# Altium schematic sheet STM32.SchDoc
size A0; SheetNumber: 1; SheetTotal: 1
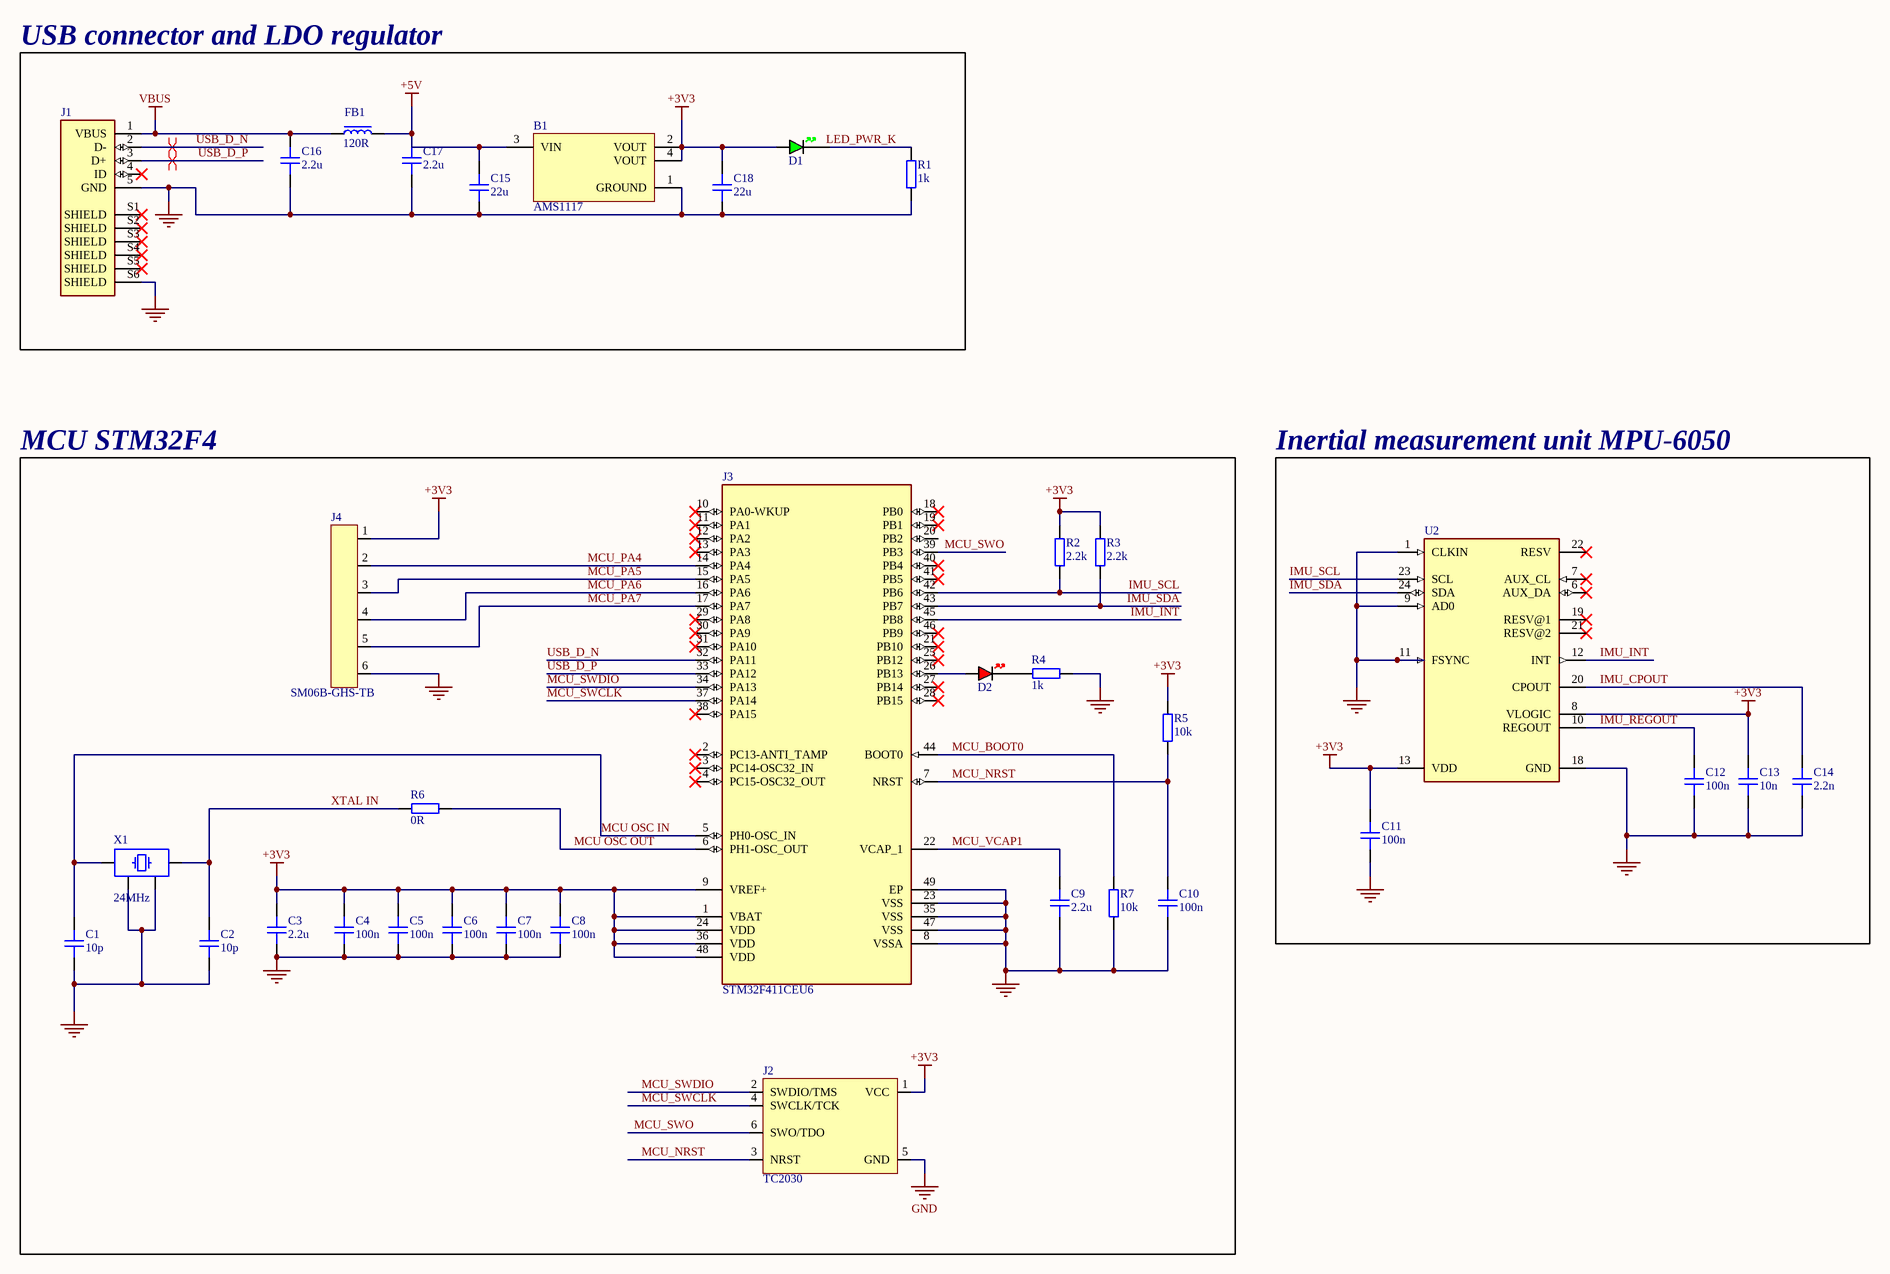
[diagram p0: STM32.SchDoc]

## Parts
B1  AMS1117  [SOT229P700X180-4N]
C1  10p  [CAP_0603]
C2  10p  [CAP_0603]
C3  2.2u  [CAP_0603]
C4  100n  [CAP_0402]
C5  100n  [CAP_0402]
C6  100n  [CAP_0402]
C7  100n  [CAP_0402]
C8  100n  [CAP_0402]
C9  2.2u  [CAP_0603]
C10  100n  [CAP_0402]
C11  100n  [CAP_0402]
C12  100n  [CAP_0402]
C13  10n  [CAP_0402]
C14  2.2n  [CAP_0402]
C15  22u  [CAP_0603]
C16  2.2u  [CAP_0603]
C17  2.2u  [CAP_0603]
C18  22u  [CAP_0603]
D1  GREEN  [LED_0402_GREEN]  (value not drawn)
D2  RED  [LED_0402_RED]  (value not drawn)
FB1  120R  [FB_0603]
J1  (no value)  [MOLEX_47346-0001]
J2  TC2030  [TC2030-FP]  (no BOM)
J3  STM32F411CEU6  [QFN50P700X700X60-49N]
J4  SM06B-GHS-TB  [SM06B-GHS-TB]
R1  1k  [RES_0402]
R2  2.2k  [RES_0402]
R3  2.2k  [RES_0402]
R4  1k  [RES_0402]
R5  10k  [RES_0402]
R6  0R  [RES_0402]
R7  10k  [RES_0402]
U2  (no value)  [QFN50P400X400X95-24N]
X1  24MHz  [XTAL_3225]

## Blocks framed on the sheet
USB connector and LDO regulator: B1 C15-C18 D1 FB1 J1 R1
MCU STM32F4: C1-C10 D2 J2-J4 R2-R7 X1
Inertial measurement unit MPU-6050: C11-C14 U2

## Nets
+3V3: B1.2(VOUT) B1.4(VOUT) C3.2 C4.2 C5.2 C6.2 C7.2 C8.2 C11.2 C13.2 C18.2 D1.A J2.1(VCC) J3.1(VBAT) J3.9(VREF+) J3.24(VDD) J3.36(VDD) J3.48(VDD) J4.1 R2.1 R3.1 R5.1 U2.8(VLOGIC) U2.13(VDD)
+5V: B1.3(VIN) C15.2 C17.2 FB1.2
GND: B1.1(GROUND) C1.1 C2.1 C3.1 C4.1 C5.1 C6.1 C7.1 C8.1 C9.1 C10.1 C11.1 C12.1 C13.1 C14.1 C15.1 C16.1 C17.1 C18.1 J1.5(GND) J1.S6(SHIELD) J2.5(GND) J3.8(VSSA) J3.23(VSS) J3.35(VSS) J3.47(VSS) J3.49(EP) J4.6 R1.1 R4.1 R7.2 U2.1(CLKIN) U2.9(AD0) U2.11(FSYNC) U2.18(GND) X1.2 X1.4
VBUS: C16.2 FB1.1 J1.1(VBUS)
IMU_CPOUT: C14.2 U2.20(CPOUT)
IMU_INT: J3.45(PB8) U2.12(INT)
IMU_REGOUT: C12.2 U2.10(REGOUT)
IMU_SCL: J3.42(PB6) R2.2 U2.23(SCL)
IMU_SDA: J3.43(PB7) R3.2 U2.24(SDA)
LED_PWR_K: D1.K R1.2
MCU OSC IN: C1.2 J3.5(PH0-OSC_IN) X1.1
MCU OSC OUT: J3.6(PH1-OSC_OUT) R6.2
MCU_BOOT0: J3.44(BOOT0) R7.1
MCU_NRST: C10.2 J2.3(NRST) J3.7(NRST) R5.2
MCU_PA4: J3.14(PA4) J4.2
MCU_PA5: J3.15(PA5) J4.3
MCU_PA6: J3.16(PA6) J4.4
MCU_PA7: J3.17(PA7) J4.5
MCU_SWCLK: J2.4(SWCLK/TCK) J3.37(PA14)
MCU_SWDIO: J2.2(SWDIO/TMS) J3.34(PA13)
MCU_SWO: J2.6(SWO/TDO) J3.39(PB3)
MCU_VCAP1: C9.2 J3.22(VCAP_1)
USB_D_N: J1.2(D-) J3.32(PA11)
USB_D_P: J1.3(D+) J3.33(PA12)
XTAL IN: C2.2 R6.1 X1.3
NetD2_A: D2.A J3.26(PB13)
NetD2_K: D2.K R4.2

Not connected (* = marked no-connect by the designer): J1 4(ID)* S1(SHIELD)* S2(SHIELD)* S3(SHIELD)* S4(SHIELD)* S5(SHIELD)*; J3 2(PC13-ANTI_TAMP)* 3(PC14-OSC32_IN)* 4(PC15-OSC32_OUT)* 10(PA0-WKUP)* 11(PA1)* 12(PA2)* 13(PA3)* 18(PB0)* 19(PB1)* 20(PB2) 21(PB10)* 25(PB12)* 27(PB14)* 28(PB15)* 29(PA8)* 30(PA9)* 31(PA10)* 38(PA15)* 40(PB4)* 41(PB5)* 46(PB9)*; U2 6(AUX_DA)* 7(AUX_CL)* 19(RESV@1)* 21(RESV@2)* 22(RESV)*

## Layout directives
differential pair: USB_D_N, USB_D_P

## Library data of the parts
B1 = AMS1117: 1117; Manufacturer_Name: Advanced Monolithic Systems; Geometry.Height: 1.8mm; Manufacturer_Part_Number: AMS1117; Mouser Part Number: *; Mouser Price/Stock: *; Arrow Part Number: *; Arrow Price/Stock: *; Datasheet Link: https://datasheet.lcsc.com/szlcsc/Advanced-Monolithic-Systems-AMS-AMS1117-ADJ_C6188.pdf
C1-C3 C9 C15-C18 = CAP_0603: Capacitor SMD 0603; Manufacturer: *; Manufacturer Part Number: *; Distributor Link: *; LCSC: *; Rating: *; Dielectric: *
C4-C8 C10-C14 = CAP_0402: Capacitor SMD 0402; Manufacturer: *; Manufacturer Part Number: *; Distributor Link: *; LCSC: *; Rating: *; Dielectric: *
D1 = LED_0402_GREEN: LED 0402 GREEN SMD
D2 = LED_0402_RED: LED 0402 RED SMD
FB1 = FB_0603: Ferrite Bead SMD 0603; Manufacturer: *; Manufacturer Part Number: *; Distributor Link: *; LCSC: *
J1 = 47346-0001: USB - micro B USB 2.0 Receptacle Connector 5 Position Surface Mount, Right Angle; MF: Molex; SnapEDA_Link: https://www.snapeda.com/parts/47346-0001/Molex/view-part/?ref=snap; Package: None; MP: 47346-0001; Check_prices: https://www.snapeda.com/parts/47346-0001/Molex/view-part/?ref=eda; Purchase-URL: https://pricing.snapeda.com/search/part/47346-0001/?ref=eda; Price: None; Value: *; Availability: In Stock
J2 = TC2030: Tag-Connect No-Solder SWD Debug Connector DO NOT PLACE; Manufacturer: Tag-Connect; Manufacturer Part Number: TC2030
J3 = STM32F411VET6: IC MCU 32BIT 512KB FLASH 100LQFP; Manufacturer: STMicroelectronics; Interface: I2C,SPI,USB,IrDA,MMC,SDIO,SD,UART,USART,LIN,I2S; Number of I/Os: 81; Core Architecture: ARM; Oscillator Type: Internal; Peripherals: Brown-out Detect/Reset,POR,PWM,WDT,DMA; RAM Size: 128KB; Max Supply Voltage: 3.6V; Min Supply Voltage: 1.7V; Data Bus Width: 32b; Max Frequency: 100MHz; Operating Supply Voltage: 3.3V; Number of Timers/Counters: 8; Watchdog Timer: Yes; Number of ADC Channels: 16; Max Power Dissipation: 465mW; Supplier 1: Avnet; Manufacturer Part Number: STM32F411VET6; RoHS: Yes; Category: Microcontrollers; Stock 1: 36119; Pricing 1: 90=5.81793, 100=5.7004, 190=5.58287, 450=5.46533, 900=5.3478, 4500=5.23026, 9000=5.11273 (USD); Mount: Surface Mount; Case/Package: LQFP; Number of Pins: 100; Weight: 0.04653oz; Min Operating Temperature: -40°C; Max Operating Temperature: 85°C; Packaging: Tray; Memory Type: FLASH; Memory Size: 512KB; Series: STM32F4; Number of Programmable I/O: 81; Package Quantity: 540; Radiation Hardening: No; RoHS Compliant: Yes; Lead Free: Lead Free; ComponentLink1URL: http://www.farnell.com/datasheets/2281762.pdf?src-supplier=Farnell; ComponentLink1Description: http://www.farnell.com/datasheets/2281762.pdf?src-supplier=Farnell; ComponentLink2URL: http://www.mouser.com/ds/2/389/stm32f411ce-956237.pdf?src-supplier=Mouser; ComponentLink2Description: http://www.mouser.com/ds/2/389/stm32f411ce-956237.pdf?src-supplier=Mouser; ComponentLink3URL: http://www.st.com/content/ccc/resource/technical/document/datasheet/b3/a5/46/3b/b4/e5/4c/85/DM00115249.pdf/files/DM00115249.pdf/jcr:content/translations/en.DM00115249.pdf?src-supplier=Digi-Key; ComponentLink3Description: http://www.st.com/content/ccc/resource/technical/document/datasheet/b3/a5/46/3b/b4/e5/4c/85/DM00115249.pdf/files/DM00115249.pdf/jcr:content/translations/en.DM00115249.pdf?src-supplier=Digi-Key; ComponentLink4URL: http://www.st.com/st-web-ui/static/active/en/resource/technical/document/datasheet/DM00115249.pdf?src-supplier=Avnet; ComponentLink4Description: http://www.st.com/st-web-ui/static/active/en/resource/technical/document/datasheet/DM00115249.pdf?src-supplier=Avnet; ComponentLink5URL: https://datasheet.octopart.com/STM32F411VET6-STMicroelectronics-datasheet-82511007.pdf?src-supplier=SHENGYU+ELECTRONICS; ComponentLink5Description: https://datasheet.octopart.com/STM32F411VET6-STMicroelectronics-datasheet-82511007.pdf?src-supplier=SHENGYU+ELECTRONICS
J4 = SM06B-GHS-TB: Header Connector 6 Position 1.25MM Pitch SMD Horizontal JST GH; Manufacturer: JST; Manufacturer Part Number: SM06B-GHS-TB
R1-R7 = RES_0402: Resistor SMD 0402; Manufacturer: *; Manufacturer Part Number: *; Distributor Link: *; LCSC: *
U2 = MPU-6050: MPU-6050 series Accelerometer, Gyroscope, 3 Axis Sensor Evaluation Board; MF: TDK InvenSense; Value: *; SnapEDA_Link: https://www.snapeda.com/parts/MPU-6050/TDK+InvenSense/view-part/?ref=snap; Purchase-URL: https://pricing.snapeda.com/search/part/MPU-6050/?ref=eda; Availability: In Stock; Price: None; Package: QFN-24 InvenSense; Check_prices: https://www.snapeda.com/parts/MPU-6050/TDK+InvenSense/view-part/?ref=eda; MP: MPU-6050
X1 = TSX-3225_24.0000MF15X-AC: Crystal SMD 24MHz 10PPM 7pF 3225; Manufacturer: Epson; Manufacturer Part Number: TSX-3225 24.0000MF15X-AC